# Altium project CNFET_PCB.PrjPcb (part 1 of 2)
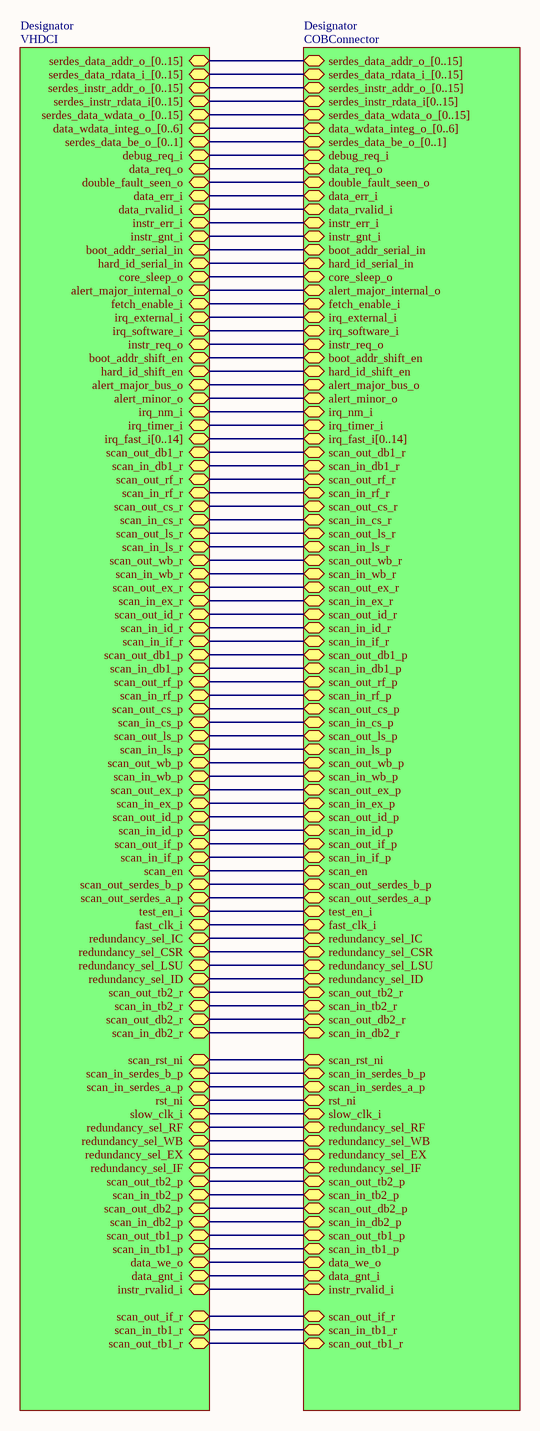
[diagram p0: Main.SchDoc]
3 sheets, 44 parts. Net scope: hierarchical (ports join the sheet entries above them; power ports are global).
Board file: CNFET.PcbDoc
Sheets:
  Main.SchDoc
    Designator = VHDCI.SchDoc
    Designator = COBConnector.SchDoc

## Sheet Main.SchDoc
size B portrait; SheetNumber: 1; SheetTotal: 3

### Sub-sheets
Designator = VHDCI: serdes_data_addr_o_[0..15] (bidir), serdes_data_rdata_i_[0..15] (bidir), serdes_instr_addr_o_[0..15] (bidir), serdes_instr_rdata_i[0..15] (bidir), serdes_data_wdata_o_[0..15] (bidir), data_wdata_integ_o_[0..6] (bidir), serdes_data_be_o_[0..1] (bidir), data_req_o (bidir), double_fault_seen_o (bidir), data_err_i (bidir), data_rvalid_i (bidir), instr_err_i (bidir), instr_gnt_i (bidir), boot_addr_serial_in (bidir), hard_id_serial_in (bidir), core_sleep_o (bidir), alert_major_internal_o (bidir), fetch_enable_i (bidir), irq_external_i (bidir), irq_software_i (bidir), instr_req_o (bidir), boot_addr_shift_en (bidir), hard_id_shift_en (bidir), alert_major_bus_o (bidir), alert_minor_o (bidir), irq_nm_i (bidir), irq_timer_i (bidir), irq_fast_i[0..14] (bidir), scan_out_db1_r (bidir), scan_in_db1_r (bidir), scan_out_rf_r (bidir), scan_in_rf_r (bidir), scan_out_cs_r (bidir), scan_in_cs_r (bidir), scan_out_ls_r (bidir), scan_in_ls_r (bidir), scan_out_wb_r (bidir), scan_in_wb_r (bidir), scan_out_ex_r (bidir), scan_in_ex_r (bidir), scan_out_id_r (bidir), scan_in_id_r (bidir), scan_out_if_r (bidir), scan_in_if_r (bidir), scan_out_db1_p (bidir), scan_in_db1_p (bidir), scan_out_rf_p (bidir), scan_in_rf_p (bidir), scan_out_cs_p (bidir), scan_in_cs_p (bidir), scan_out_ls_p (bidir), scan_in_ls_p (bidir), scan_out_wb_p (bidir), scan_in_wb_p (bidir), scan_out_ex_p (bidir), scan_in_ex_p (bidir), scan_out_id_p (bidir), scan_in_id_p (bidir), scan_out_if_p (bidir), scan_in_if_p (bidir), scan_en (bidir), scan_out_serdes_b_p (bidir), scan_out_serdes_a_p (bidir), test_en_i (bidir), fast_clk_i (bidir), redundancy_sel_IC (bidir), redundancy_sel_CSR (bidir), redundancy_sel_LSU (bidir), redundancy_sel_ID (bidir), scan_out_tb2_r (bidir), scan_in_tb2_r (bidir), scan_out_db2_r (bidir), scan_in_db2_r (bidir), scan_rst_ni (bidir), scan_in_serdes_b_p (bidir), scan_in_serdes_a_p (bidir), rst_ni (bidir), slow_clk_i (bidir), redundancy_sel_RF (bidir), redundancy_sel_WB (bidir), redundancy_sel_EX (bidir), redundancy_sel_IF (bidir), scan_out_tb2_p (bidir), scan_in_tb2_p (bidir), scan_out_db2_p (bidir), scan_in_db2_p (bidir), scan_out_tb1_p (bidir), scan_in_tb1_p (bidir), debug_req_i (bidir), data_we_o (bidir), data_gnt_i (bidir), instr_rvalid_i (bidir), scan_in_tb1_r (bidir), scan_out_tb1_r (bidir)
Designator = COBConnector: serdes_data_addr_o_[0..15] (bidir), serdes_data_rdata_i_[0..15] (bidir), serdes_instr_addr_o_[0..15] (bidir), serdes_data_wdata_o_[0..15] (bidir), data_wdata_integ_o_[0..6] (bidir), serdes_data_be_o_[0..1] (bidir), debug_req_i (bidir), data_req_o (bidir), double_fault_seen_o (bidir), data_err_i (bidir), data_rvalid_i (bidir), data_we_o (bidir), data_gnt_i (bidir), instr_err_i (bidir), instr_gnt_i (bidir), boot_addr_serial_in (bidir), hard_id_serial_in (bidir), core_sleep_o (bidir), alert_major_internal_o (bidir), fetch_enable_i (bidir), irq_external_i (bidir), irq_software_i (bidir), instr_req_o (bidir), boot_addr_shift_en (bidir), hard_id_shift_en (bidir), alert_major_bus_o (bidir), alert_minor_o (bidir), irq_nm_i (bidir), irq_timer_i (bidir), irq_fast_i[0..14] (bidir), scan_out_db1_r (bidir), scan_in_db1_r (bidir), scan_out_rf_r (bidir), scan_in_rf_r (bidir), scan_out_cs_r (bidir), scan_in_cs_r (bidir), scan_out_ls_r (bidir), scan_in_ls_r (bidir), scan_out_wb_r (bidir), scan_in_wb_r (bidir), scan_out_ex_r (bidir), scan_in_ex_r (bidir), scan_out_id_r (bidir), scan_out_if_r (bidir), scan_in_if_r (bidir), scan_out_db1_p (bidir), scan_in_db1_p (bidir), scan_out_rf_p (bidir), scan_in_rf_p (bidir), scan_out_cs_p (bidir), scan_in_cs_p (bidir), scan_out_ls_p (bidir), scan_in_ls_p (bidir), scan_out_wb_p (bidir), scan_in_wb_p (bidir), scan_out_ex_p (bidir), scan_in_ex_p (bidir), scan_out_id_p (bidir), scan_in_id_p (bidir), scan_out_if_p (bidir), scan_in_if_p (bidir), scan_en (bidir), scan_out_serdes_b_p (bidir), scan_out_serdes_a_p (bidir), test_en_i (bidir), fast_clk_i (bidir), redundancy_sel_IC (bidir), redundancy_sel_CSR (bidir), redundancy_sel_LSU (bidir), redundancy_sel_ID (bidir), scan_out_tb2_r (bidir), scan_in_tb2_r (bidir), scan_out_db2_r (bidir), scan_in_db2_r (bidir), scan_rst_ni (bidir), scan_in_serdes_b_p (bidir), scan_in_serdes_a_p (bidir), rst_ni (bidir), slow_clk_i (bidir), redundancy_sel_RF (bidir), redundancy_sel_WB (bidir), redundancy_sel_EX (bidir), redundancy_sel_IF (bidir), scan_out_tb2_p (bidir), scan_in_tb2_p (bidir), scan_out_db2_p (bidir), scan_in_db2_p (bidir), scan_out_tb1_p (bidir), scan_in_tb1_p (bidir), scan_in_id_r (bidir), serdes_instr_rdata_i[0..15] (bidir), instr_rvalid_i (bidir), scan_out_tb1_r (bidir), scan_in_tb1_r (bidir)

### Nets
alert_major_bus_o: sheet Designator/alert_major_bus_o, sheet Designator/alert_major_bus_o
alert_major_internal_o: sheet Designator/alert_major_internal_o, sheet Designator/alert_major_internal_o
alert_minor_o: sheet Designator/alert_minor_o, sheet Designator/alert_minor_o
boot_addr_serial_in: sheet Designator/boot_addr_serial_in, sheet Designator/boot_addr_serial_in
boot_addr_shift_en: sheet Designator/boot_addr_shift_en, sheet Designator/boot_addr_shift_en
core_sleep_o: sheet Designator/core_sleep_o, sheet Designator/core_sleep_o
data_err_i: sheet Designator/data_err_i, sheet Designator/data_err_i
data_gnt_i: sheet Designator/data_gnt_i, sheet Designator/data_gnt_i
data_req_o: sheet Designator/data_req_o, sheet Designator/data_req_o
data_rvalid_i: sheet Designator/data_rvalid_i, sheet Designator/data_rvalid_i
data_we_o: sheet Designator/data_we_o, sheet Designator/data_we_o
debug_req_i: sheet Designator/debug_req_i, sheet Designator/debug_req_i
double_fault_seen_o: sheet Designator/double_fault_seen_o, sheet Designator/double_fault_seen_o
fast_clk_i: sheet Designator/fast_clk_i, sheet Designator/fast_clk_i
fetch_enable_i: sheet Designator/fetch_enable_i, sheet Designator/fetch_enable_i
hard_id_serial_in: sheet Designator/hard_id_serial_in, sheet Designator/hard_id_serial_in
hard_id_shift_en: sheet Designator/hard_id_shift_en, sheet Designator/hard_id_shift_en
instr_err_i: sheet Designator/instr_err_i, sheet Designator/instr_err_i
instr_gnt_i: sheet Designator/instr_gnt_i, sheet Designator/instr_gnt_i
instr_req_o: sheet Designator/instr_req_o, sheet Designator/instr_req_o
instr_rvalid_i: sheet Designator/instr_rvalid_i, sheet Designator/instr_rvalid_i
irq_external_i: sheet Designator/irq_external_i, sheet Designator/irq_external_i
irq_nm_i: sheet Designator/irq_nm_i, sheet Designator/irq_nm_i
irq_software_i: sheet Designator/irq_software_i, sheet Designator/irq_software_i
irq_timer_i: sheet Designator/irq_timer_i, sheet Designator/irq_timer_i
redundancy_sel_CSR: sheet Designator/redundancy_sel_CSR, sheet Designator/redundancy_sel_CSR
redundancy_sel_EX: sheet Designator/redundancy_sel_EX, sheet Designator/redundancy_sel_EX
redundancy_sel_IC: sheet Designator/redundancy_sel_IC, sheet Designator/redundancy_sel_IC
redundancy_sel_ID: sheet Designator/redundancy_sel_ID, sheet Designator/redundancy_sel_ID
redundancy_sel_IF: sheet Designator/redundancy_sel_IF, sheet Designator/redundancy_sel_IF
redundancy_sel_LSU: sheet Designator/redundancy_sel_LSU, sheet Designator/redundancy_sel_LSU
redundancy_sel_RF: sheet Designator/redundancy_sel_RF, sheet Designator/redundancy_sel_RF
redundancy_sel_WB: sheet Designator/redundancy_sel_WB, sheet Designator/redundancy_sel_WB
rst_ni: sheet Designator/rst_ni, sheet Designator/rst_ni
scan_en: sheet Designator/scan_en, sheet Designator/scan_en
scan_in_cs_p: sheet Designator/scan_in_cs_p, sheet Designator/scan_in_cs_p
scan_in_cs_r: sheet Designator/scan_in_cs_r, sheet Designator/scan_in_cs_r
scan_in_db1_p: sheet Designator/scan_in_db1_p, sheet Designator/scan_in_db1_p
scan_in_db1_r: sheet Designator/scan_in_db1_r, sheet Designator/scan_in_db1_r
scan_in_db2_p: sheet Designator/scan_in_db2_p, sheet Designator/scan_in_db2_p
scan_in_db2_r: sheet Designator/scan_in_db2_r, sheet Designator/scan_in_db2_r
scan_in_ex_p: sheet Designator/scan_in_ex_p, sheet Designator/scan_in_ex_p
scan_in_ex_r: sheet Designator/scan_in_ex_r, sheet Designator/scan_in_ex_r
scan_in_id_p: sheet Designator/scan_in_id_p, sheet Designator/scan_in_id_p
scan_in_id_r: sheet Designator/scan_in_id_r, sheet Designator/scan_in_id_r
scan_in_if_p: sheet Designator/scan_in_if_p, sheet Designator/scan_in_if_p
scan_in_if_r: sheet Designator/scan_in_if_r, sheet Designator/scan_in_if_r
scan_in_ls_p: sheet Designator/scan_in_ls_p, sheet Designator/scan_in_ls_p
scan_in_ls_r: sheet Designator/scan_in_ls_r, sheet Designator/scan_in_ls_r
scan_in_rf_p: sheet Designator/scan_in_rf_p, sheet Designator/scan_in_rf_p
scan_in_rf_r: sheet Designator/scan_in_rf_r, sheet Designator/scan_in_rf_r
scan_in_serdes_a_p: sheet Designator/scan_in_serdes_a_p, sheet Designator/scan_in_serdes_a_p
scan_in_serdes_b_p: sheet Designator/scan_in_serdes_b_p, sheet Designator/scan_in_serdes_b_p
scan_in_tb1_p: sheet Designator/scan_in_tb1_p, sheet Designator/scan_in_tb1_p
scan_in_tb1_r: sheet Designator/scan_in_tb1_r, sheet Designator/scan_in_tb1_r
scan_in_tb2_p: sheet Designator/scan_in_tb2_p, sheet Designator/scan_in_tb2_p
scan_in_tb2_r: sheet Designator/scan_in_tb2_r, sheet Designator/scan_in_tb2_r
scan_in_wb_p: sheet Designator/scan_in_wb_p, sheet Designator/scan_in_wb_p
scan_in_wb_r: sheet Designator/scan_in_wb_r, sheet Designator/scan_in_wb_r
scan_out_cs_p: sheet Designator/scan_out_cs_p, sheet Designator/scan_out_cs_p
scan_out_cs_r: sheet Designator/scan_out_cs_r, sheet Designator/scan_out_cs_r
scan_out_db1_p: sheet Designator/scan_out_db1_p, sheet Designator/scan_out_db1_p
scan_out_db1_r: sheet Designator/scan_out_db1_r, sheet Designator/scan_out_db1_r
scan_out_db2_p: sheet Designator/scan_out_db2_p, sheet Designator/scan_out_db2_p
scan_out_db2_r: sheet Designator/scan_out_db2_r, sheet Designator/scan_out_db2_r
scan_out_ex_p: sheet Designator/scan_out_ex_p, sheet Designator/scan_out_ex_p
scan_out_ex_r: sheet Designator/scan_out_ex_r, sheet Designator/scan_out_ex_r
scan_out_id_p: sheet Designator/scan_out_id_p, sheet Designator/scan_out_id_p
scan_out_id_r: sheet Designator/scan_out_id_r, sheet Designator/scan_out_id_r
scan_out_if_p: sheet Designator/scan_out_if_p, sheet Designator/scan_out_if_p
scan_out_if_r: sheet Designator/scan_out_if_r, sheet Designator/scan_out_if_r
scan_out_ls_p: sheet Designator/scan_out_ls_p, sheet Designator/scan_out_ls_p
scan_out_ls_r: sheet Designator/scan_out_ls_r, sheet Designator/scan_out_ls_r
scan_out_rf_p: sheet Designator/scan_out_rf_p, sheet Designator/scan_out_rf_p
scan_out_rf_r: sheet Designator/scan_out_rf_r, sheet Designator/scan_out_rf_r
scan_out_serdes_a_p: sheet Designator/scan_out_serdes_a_p, sheet Designator/scan_out_serdes_a_p
scan_out_serdes_b_p: sheet Designator/scan_out_serdes_b_p, sheet Designator/scan_out_serdes_b_p
scan_out_tb1_p: sheet Designator/scan_out_tb1_p, sheet Designator/scan_out_tb1_p
scan_out_tb1_r: sheet Designator/scan_out_tb1_r, sheet Designator/scan_out_tb1_r
scan_out_tb2_p: sheet Designator/scan_out_tb2_p, sheet Designator/scan_out_tb2_p
scan_out_tb2_r: sheet Designator/scan_out_tb2_r, sheet Designator/scan_out_tb2_r
scan_out_wb_p: sheet Designator/scan_out_wb_p, sheet Designator/scan_out_wb_p
scan_out_wb_r: sheet Designator/scan_out_wb_r, sheet Designator/scan_out_wb_r
scan_rst_ni: sheet Designator/scan_rst_ni, sheet Designator/scan_rst_ni
slow_clk_i: sheet Designator/slow_clk_i, sheet Designator/slow_clk_i
test_en_i: sheet Designator/test_en_i, sheet Designator/test_en_i

## Sheet VHDCI.SchDoc
size C; SheetNumber: 3; SheetTotal: 3
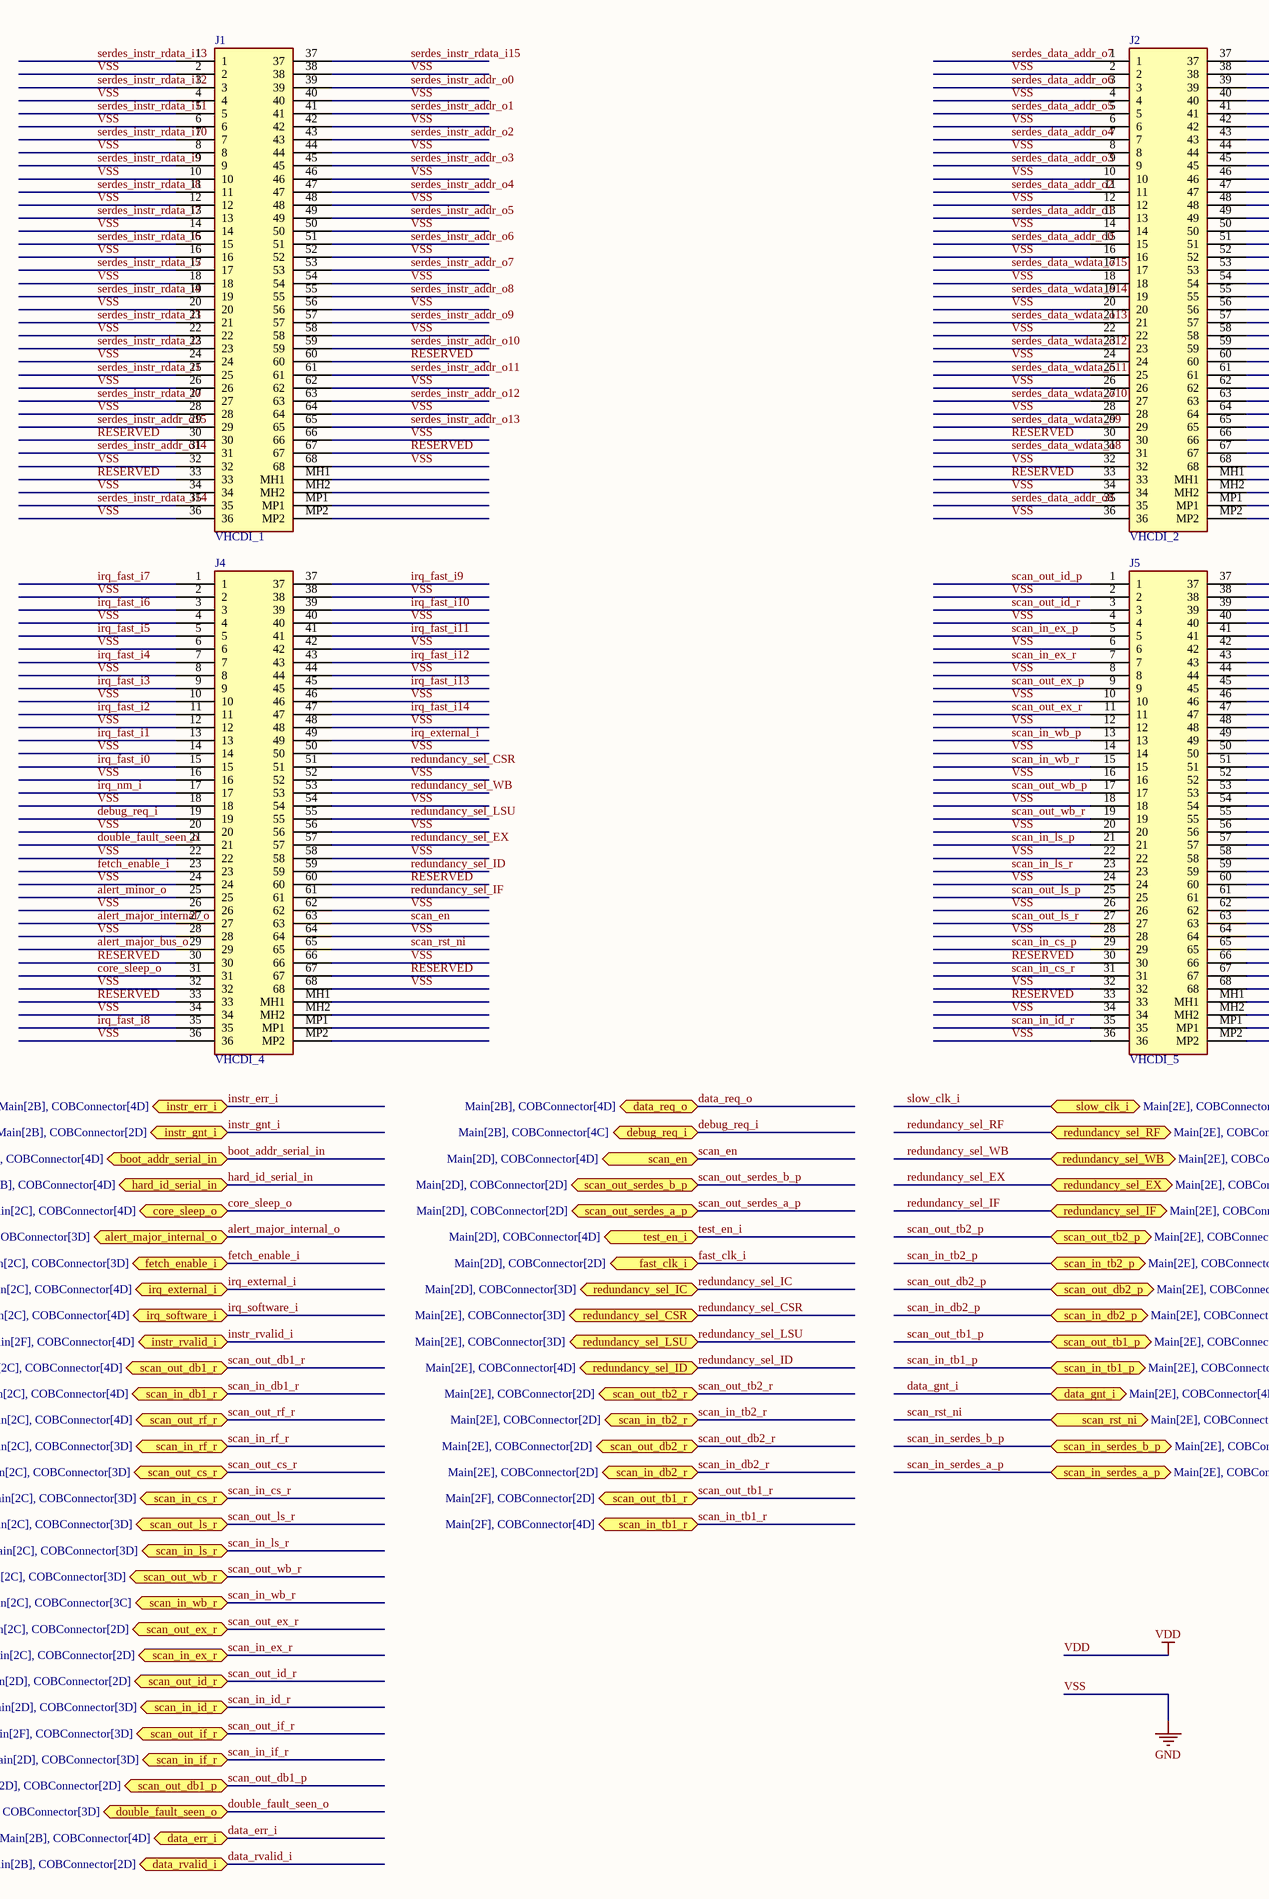
[diagram p1: VHDCI.SchDoc, left]
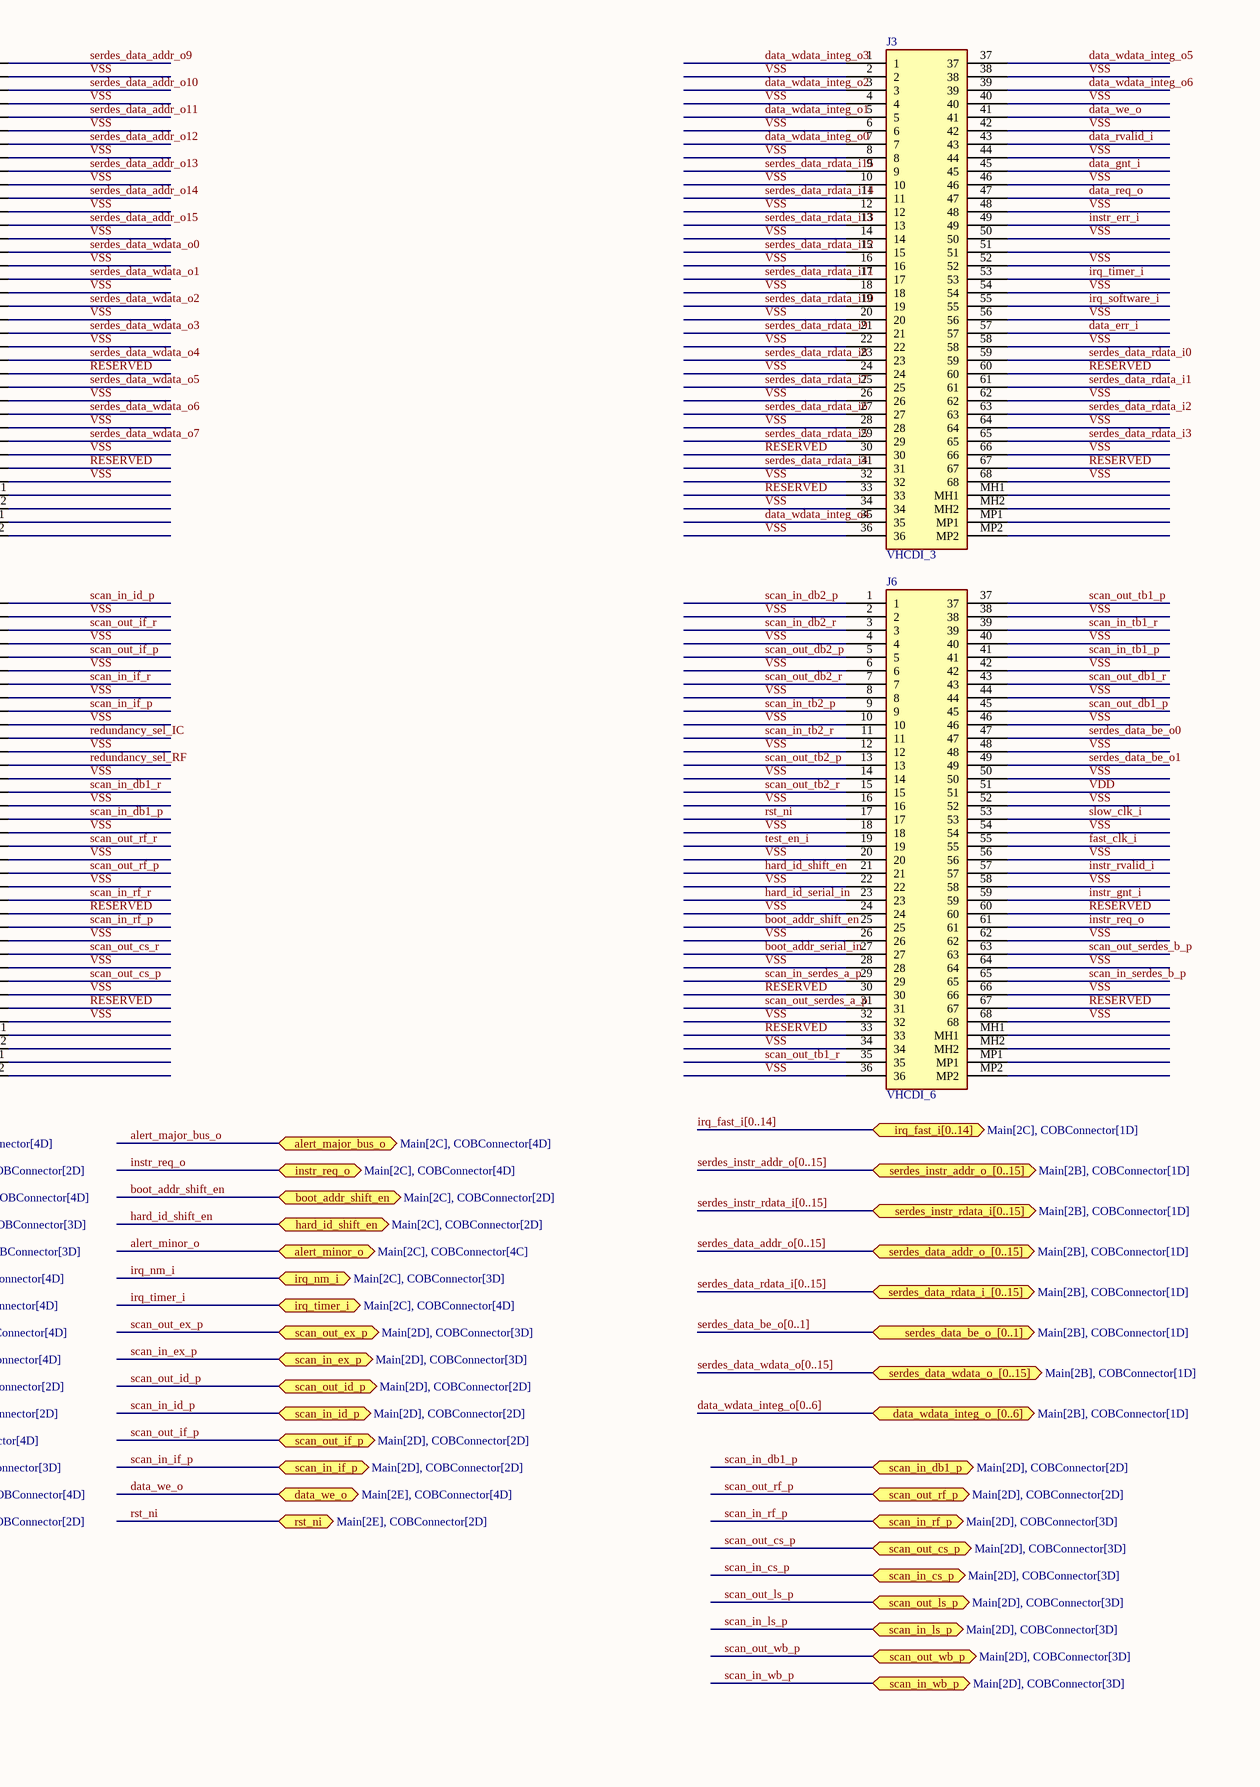
[diagram p2: VHDCI.SchDoc, right]

### Parts
J1  VHCDI_1  [CONN68_HDRA-EC_HON]
J2  VHCDI_2  [CONN68_HDRA-EC_HON]
J3  VHCDI_3  [CONN68_HDRA-EC_HON]
J4  VHCDI_4  [CONN68_HDRA-EC_HON]
J5  VHCDI_5  [CONN68_HDRA-EC_HON]
J6  VHCDI_6  [CONN68_HDRA-EC_HON]

### Ports
alert_major_bus_o (bidir, see Main[2C], COBConnector[4D]), alert_major_internal_o (bidir, see Main[2C], COBConnector[3D]), alert_minor_o (bidir, see Main[2C], COBConnector[4C]), boot_addr_serial_in (bidir, see Main[2B], COBConnector[4D]), boot_addr_shift_en (bidir, see Main[2C], COBConnector[2D]), core_sleep_o (bidir, see Main[2C], COBConnector[4D]), data_err_i (bidir, see Main[2B], COBConnector[4D]), data_gnt_i (bidir, see Main[2E], COBConnector[4D]), data_req_o (bidir, see Main[2B], COBConnector[4D]), data_rvalid_i (bidir, see Main[2B], COBConnector[2D]), data_wdata_integ_o_[0..6] (bidir, see Main[2B], COBConnector[1D]), data_we_o (bidir, see Main[2E], COBConnector[4D]), debug_req_i (bidir, see Main[2B], COBConnector[4C]), double_fault_seen_o (bidir, see Main[2B], COBConnector[3D]), fast_clk_i (bidir, see Main[2D], COBConnector[2D]), fetch_enable_i (bidir, see Main[2C], COBConnector[3D]), hard_id_serial_in (bidir, see Main[2B], COBConnector[4D]), hard_id_shift_en (bidir, see Main[2C], COBConnector[2D]), instr_err_i (bidir, see Main[2B], COBConnector[4D]), instr_gnt_i (bidir, see Main[2B], COBConnector[2D]), instr_req_o (bidir, see Main[2C], COBConnector[4D]), instr_rvalid_i (bidir, see Main[2F], COBConnector[4D]), irq_external_i (bidir, see Main[2C], COBConnector[4D]), irq_fast_i[0..14] (bidir, see Main[2C], COBConnector[1D]), irq_nm_i (bidir, see Main[2C], COBConnector[3D]), irq_software_i (bidir, see Main[2C], COBConnector[4D]), irq_timer_i (bidir, see Main[2C], COBConnector[4D]), redundancy_sel_CSR (bidir, see Main[2E], COBConnector[3D]), redundancy_sel_EX (bidir, see Main[2E], COBConnector[3D]), redundancy_sel_IC (bidir, see Main[2D], COBConnector[3D]), redundancy_sel_ID (bidir, see Main[2E], COBConnector[4D]), redundancy_sel_IF (bidir, see Main[2E], COBConnector[3D]), redundancy_sel_LSU (bidir, see Main[2E], COBConnector[3D]), redundancy_sel_RF (bidir, see Main[2E], COBConnector[2D]), redundancy_sel_WB (bidir, see Main[2E], COBConnector[4D]), rst_ni (bidir, see Main[2E], COBConnector[2D]), scan_en (bidir, see Main[2D], COBConnector[4D]), scan_in_cs_p (bidir, see Main[2D], COBConnector[3D]), scan_in_cs_r (bidir, see Main[2C], COBConnector[3D]), scan_in_db1_p (bidir, see Main[2D], COBConnector[2D]), scan_in_db1_r (bidir, see Main[2C], COBConnector[4D]), scan_in_db2_p (bidir, see Main[2E], COBConnector[4D]), scan_in_db2_r (bidir, see Main[2E], COBConnector[2D]), scan_in_ex_p (bidir, see Main[2D], COBConnector[3D]), scan_in_ex_r (bidir, see Main[2C], COBConnector[2D]), scan_in_id_p (bidir, see Main[2D], COBConnector[2D]), scan_in_id_r (bidir, see Main[2D], COBConnector[3D]), scan_in_if_p (bidir, see Main[2D], COBConnector[2D]), scan_in_if_r (bidir, see Main[2D], COBConnector[3D]), scan_in_ls_p (bidir, see Main[2D], COBConnector[3D]), scan_in_ls_r (bidir, see Main[2C], COBConnector[3D]), scan_in_rf_p (bidir, see Main[2D], COBConnector[3D]), scan_in_rf_r (bidir, see Main[2C], COBConnector[3D]), scan_in_serdes_a_p (bidir, see Main[2E], COBConnector[2D]), scan_in_serdes_b_p (bidir, see Main[2E], COBConnector[4D]), scan_in_tb1_p (bidir, see Main[2E], COBConnector[2D]), scan_in_tb1_r (bidir, see Main[2F], COBConnector[4D]), scan_in_tb2_p (bidir, see Main[2E], COBConnector[4D]), scan_in_tb2_r (bidir, see Main[2E], COBConnector[2D]), scan_in_wb_p (bidir, see Main[2D], COBConnector[3D]), scan_in_wb_r (bidir, see Main[2C], COBConnector[3C]), scan_out_cs_p (bidir, see Main[2D], COBConnector[3D]), scan_out_cs_r (bidir, see Main[2C], COBConnector[3D]), scan_out_db1_p (bidir, see Main[2D], COBConnector[2D]), scan_out_db1_r (bidir, see Main[2C], COBConnector[4D]), scan_out_db2_p (bidir, see Main[2E], COBConnector[4D]), scan_out_db2_r (bidir, see Main[2E], COBConnector[2D]), scan_out_ex_p (bidir, see Main[2D], COBConnector[3D]), scan_out_ex_r (bidir, see Main[2C], COBConnector[2D]), scan_out_id_p (bidir, see Main[2D], COBConnector[2D]), scan_out_id_r (bidir, see Main[2D], COBConnector[2D]), scan_out_if_p (bidir, see Main[2D], COBConnector[2D]), scan_out_if_r (bidir, see Main[2F], COBConnector[3D]), scan_out_ls_p (bidir, see Main[2D], COBConnector[3D]), scan_out_ls_r (bidir, see Main[2C], COBConnector[3D]), scan_out_rf_p (bidir, see Main[2D], COBConnector[2D]), scan_out_rf_r (bidir, see Main[2C], COBConnector[4D]), scan_out_serdes_a_p (bidir, see Main[2D], COBConnector[2D]), scan_out_serdes_b_p (bidir, see Main[2D], COBConnector[2D]), scan_out_tb1_p (bidir, see Main[2E], COBConnector[2D]), scan_out_tb1_r (bidir, see Main[2F], COBConnector[2D]), scan_out_tb2_p (bidir, see Main[2E], COBConnector[4D]), scan_out_tb2_r (bidir, see Main[2E], COBConnector[2D]), scan_out_wb_p (bidir, see Main[2D], COBConnector[3D]), scan_out_wb_r (bidir, see Main[2C], COBConnector[3D]), scan_rst_ni (bidir, see Main[2E], COBConnector[3D]), serdes_data_addr_o_[0..15] (bidir, see Main[2B], COBConnector[1D]), serdes_data_be_o_[0..1] (bidir, see Main[2B], COBConnector[1D]), serdes_data_rdata_i_[0..15] (bidir, see Main[2B], COBConnector[1D]), serdes_data_wdata_o_[0..15] (bidir, see Main[2B], COBConnector[1D]), serdes_instr_addr_o_[0..15] (bidir, see Main[2B], COBConnector[1D]), serdes_instr_rdata_i[0..15] (bidir, see Main[2B], COBConnector[1D]), slow_clk_i (bidir, see Main[2E], COBConnector[4D]), test_en_i (bidir, see Main[2D], COBConnector[4D])

### Nets
VDD: J6.51
VSS: J1.2 J1.4 J1.6 J1.8 J1.10 J1.12 J1.14 J1.16 J1.18 J1.20 J1.22 J1.24 J1.26 J1.28 J1.32 J1.34 J1.36 J1.38 J1.40 J1.42 J1.44 J1.46 J1.48 J1.50 J1.52 J1.54 J1.56 J1.58 J1.62 J1.64 J1.66 J1.68 J2.2 J2.4 J2.6 J2.8 J2.10 J2.12 J2.14 J2.16 J2.18 J2.20 J2.22 J2.24 J2.26 J2.28 J2.32 J2.34 J2.36 J2.38 J2.40 J2.42 J2.44 J2.46 J2.48 J2.50 J2.52 J2.54 J2.56 J2.58 J2.62 J2.64 J2.66 J2.68 J3.2 J3.4 J3.6 J3.8 J3.10 J3.12 J3.14 J3.16 J3.18 J3.20 J3.22 J3.24 J3.26 J3.28 J3.32 J3.34 J3.36 J3.38 J3.40 J3.42 J3.44 J3.46 J3.48 J3.50 J3.52 J3.54 J3.56 J3.58 J3.62 J3.64 J3.66 J3.68 J4.2 J4.4 J4.6 J4.8 J4.10 J4.12 J4.14 J4.16 J4.18 J4.20 J4.22 J4.24 J4.26 J4.28 J4.32 J4.34 J4.36 J4.38 J4.40 J4.42 J4.44 J4.46 J4.48 J4.50 J4.52 J4.54 J4.56 J4.58 J4.62 J4.64 J4.66 J4.68 J5.2 J5.4 J5.6 J5.8 J5.10 J5.12 J5.14 J5.16 J5.18 J5.20 J5.22 J5.24 J5.26 J5.28 J5.32 J5.34 J5.36 J5.38 J5.40 J5.42 J5.44 J5.46 J5.48 J5.50 J5.52 J5.54 J5.56 J5.58 J5.62 J5.64 J5.66 J5.68 J6.2 J6.4 J6.6 J6.8 J6.10 J6.12 J6.14 J6.16 J6.18 J6.20 J6.22 J6.24 J6.26 J6.28 J6.32 J6.34 J6.36 J6.38 J6.40 J6.42 J6.44 J6.46 J6.48 J6.50 J6.52 J6.54 J6.56 J6.58 J6.62 J6.64 J6.66 J6.68  [also labelled GND]
alert_major_bus_o: J4.29 ; port alert_major_bus_o
alert_major_internal_o: J4.27 ; port alert_major_internal_o
alert_minor_o: J4.25 ; port alert_minor_o
boot_addr_serial_in: J6.27 ; port boot_addr_serial_in
boot_addr_shift_en: J6.25 ; port boot_addr_shift_en
core_sleep_o: J4.31 ; port core_sleep_o
data_err_i: J3.57 ; port data_err_i
data_gnt_i: J3.45 ; port data_gnt_i
data_req_o: J3.47 ; port data_req_o
data_rvalid_i: J3.43 ; port data_rvalid_i
data_wdata_integ_o0: J3.7
data_wdata_integ_o1: J3.5
data_wdata_integ_o2: J3.3
data_wdata_integ_o3: J3.1
data_wdata_integ_o4: J3.35
data_wdata_integ_o5: J3.37
data_wdata_integ_o6: J3.39
data_we_o: J3.41 ; port data_we_o
debug_req_i: J4.19 ; port debug_req_i
double_fault_seen_o: J4.21 ; port double_fault_seen_o
fast_clk_i: J6.55 ; port fast_clk_i
fetch_enable_i: J4.23 ; port fetch_enable_i
hard_id_serial_in: J6.23 ; port hard_id_serial_in
hard_id_shift_en: J6.21 ; port hard_id_shift_en
instr_err_i: J3.49 ; port instr_err_i
instr_gnt_i: J6.59 ; port instr_gnt_i
instr_req_o: J6.61 ; port instr_req_o
instr_rvalid_i: J6.57 ; port instr_rvalid_i
irq_external_i: J4.49 ; port irq_external_i
irq_fast_i0: J4.15
irq_fast_i1: J4.13
irq_fast_i2: J4.11
irq_fast_i3: J4.9
irq_fast_i4: J4.7
irq_fast_i5: J4.5
irq_fast_i6: J4.3
irq_fast_i7: J4.1
irq_fast_i8: J4.35
irq_fast_i9: J4.37
irq_fast_i10: J4.39
irq_fast_i11: J4.41
irq_fast_i12: J4.43
irq_fast_i13: J4.45
irq_fast_i14: J4.47
irq_nm_i: J4.17 ; port irq_nm_i
irq_software_i: J3.55 ; port irq_software_i
irq_timer_i: J3.53 ; port irq_timer_i
redundancy_sel_CSR: J4.51 ; port redundancy_sel_CSR
redundancy_sel_EX: J4.57 ; port redundancy_sel_EX
redundancy_sel_IC: J5.47 ; port redundancy_sel_IC
redundancy_sel_ID: J4.59 ; port redundancy_sel_ID
redundancy_sel_IF: J4.61 ; port redundancy_sel_IF
redundancy_sel_LSU: J4.55 ; port redundancy_sel_LSU
redundancy_sel_RF: J5.49 ; port redundancy_sel_RF
redundancy_sel_WB: J4.53 ; port redundancy_sel_WB
RESERVED: J1.30 J1.33 J1.60 J1.67 J2.30 J2.33 J2.60 J2.67 J3.30 J3.33 J3.60 J3.67 J4.30 J4.33 J4.60 J4.67 J5.30 J5.33 J5.60 J5.67 J6.30 J6.33 J6.60 J6.67
rst_ni: J6.17 ; port rst_ni
scan_en: J4.63 ; port scan_en
scan_in_cs_p: J5.29 ; port scan_in_cs_p
scan_in_cs_r: J5.31 ; port scan_in_cs_r
scan_in_db1_p: J5.53 ; port scan_in_db1_p
scan_in_db1_r: J5.51 ; port scan_in_db1_r
scan_in_db2_p: J6.1 ; port scan_in_db2_p
scan_in_db2_r: J6.3 ; port scan_in_db2_r
scan_in_ex_p: J5.5 ; port scan_in_ex_p
scan_in_ex_r: J5.7 ; port scan_in_ex_r
scan_in_id_p: J5.37 ; port scan_in_id_p
scan_in_id_r: J5.35 ; port scan_in_id_r
scan_in_if_p: J5.45 ; port scan_in_if_p
scan_in_if_r: J5.43 ; port scan_in_if_r
scan_in_ls_p: J5.21 ; port scan_in_ls_p
scan_in_ls_r: J5.23 ; port scan_in_ls_r
scan_in_rf_p: J5.61 ; port scan_in_rf_p
scan_in_rf_r: J5.59 ; port scan_in_rf_r
scan_in_serdes_a_p: J6.29 ; port scan_in_serdes_a_p
scan_in_serdes_b_p: J6.65 ; port scan_in_serdes_b_p
scan_in_tb1_p: J6.41 ; port scan_in_tb1_p
scan_in_tb1_r: J6.39 ; port scan_in_tb1_r
scan_in_tb2_p: J6.9 ; port scan_in_tb2_p
scan_in_tb2_r: J6.11 ; port scan_in_tb2_r
scan_in_wb_p: J5.13 ; port scan_in_wb_p
scan_in_wb_r: J5.15 ; port scan_in_wb_r
scan_out_cs_p: J5.65 ; port scan_out_cs_p
scan_out_cs_r: J5.63 ; port scan_out_cs_r
scan_out_db1_p: J6.45 ; port scan_out_db1_p
scan_out_db1_r: J6.43 ; port scan_out_db1_r
scan_out_db2_p: J6.5 ; port scan_out_db2_p
scan_out_db2_r: J6.7 ; port scan_out_db2_r
scan_out_ex_p: J5.9 ; port scan_out_ex_p
scan_out_ex_r: J5.11 ; port scan_out_ex_r
scan_out_id_p: J5.1 ; port scan_out_id_p
scan_out_id_r: J5.3 ; port scan_out_id_r
scan_out_if_p: J5.41 ; port scan_out_if_p
scan_out_if_r: J5.39 ; port scan_out_if_r
scan_out_ls_p: J5.25 ; port scan_out_ls_p
scan_out_ls_r: J5.27 ; port scan_out_ls_r
scan_out_rf_p: J5.57 ; port scan_out_rf_p
scan_out_rf_r: J5.55 ; port scan_out_rf_r
scan_out_serdes_a_p: J6.31 ; port scan_out_serdes_a_p
scan_out_serdes_b_p: J6.63 ; port scan_out_serdes_b_p
scan_out_tb1_p: J6.37 ; port scan_out_tb1_p
scan_out_tb1_r: J6.35 ; port scan_out_tb1_r
scan_out_tb2_p: J6.13 ; port scan_out_tb2_p
scan_out_tb2_r: J6.15 ; port scan_out_tb2_r
scan_out_wb_p: J5.17 ; port scan_out_wb_p
scan_out_wb_r: J5.19 ; port scan_out_wb_r
scan_rst_ni: J4.65 ; port scan_rst_ni
serdes_data_addr_o0: J2.15
serdes_data_addr_o1: J2.13
serdes_data_addr_o2: J2.11
serdes_data_addr_o3: J2.9
serdes_data_addr_o4: J2.7
serdes_data_addr_o5: J2.5
serdes_data_addr_o6: J2.3
serdes_data_addr_o7: J2.1
serdes_data_addr_o8: J2.35
serdes_data_addr_o9: J2.37
serdes_data_addr_o10: J2.39
serdes_data_addr_o11: J2.41
serdes_data_addr_o12: J2.43
serdes_data_addr_o13: J2.45
serdes_data_addr_o14: J2.47
serdes_data_addr_o15: J2.49
serdes_data_be_o0: J6.47
serdes_data_be_o1: J6.49
serdes_data_rdata_i0: J3.59
serdes_data_rdata_i1: J3.61
serdes_data_rdata_i2: J3.63
serdes_data_rdata_i3: J3.65
serdes_data_rdata_i4: J3.31
serdes_data_rdata_i5: J3.29
serdes_data_rdata_i6: J3.27
serdes_data_rdata_i7: J3.25
serdes_data_rdata_i8: J3.23
serdes_data_rdata_i9: J3.21
serdes_data_rdata_i10: J3.19
serdes_data_rdata_i11: J3.17
serdes_data_rdata_i12: J3.15
serdes_data_rdata_i13: J3.13
serdes_data_rdata_i14: J3.11
serdes_data_rdata_i15: J3.9
serdes_data_wdata_o0: J2.51
serdes_data_wdata_o1: J2.53
serdes_data_wdata_o2: J2.55
serdes_data_wdata_o3: J2.57
serdes_data_wdata_o4: J2.59
serdes_data_wdata_o5: J2.61
serdes_data_wdata_o6: J2.63
serdes_data_wdata_o7: J2.65
serdes_data_wdata_o8: J2.31
serdes_data_wdata_o9: J2.29
serdes_data_wdata_o10: J2.27
serdes_data_wdata_o11: J2.25
serdes_data_wdata_o12: J2.23
serdes_data_wdata_o13: J2.21
serdes_data_wdata_o14: J2.19
serdes_data_wdata_o15: J2.17
serdes_instr_addr_o0: J1.39
serdes_instr_addr_o1: J1.41
serdes_instr_addr_o2: J1.43
serdes_instr_addr_o3: J1.45
serdes_instr_addr_o4: J1.47
serdes_instr_addr_o5: J1.49
serdes_instr_addr_o6: J1.51
serdes_instr_addr_o7: J1.53
serdes_instr_addr_o8: J1.55
serdes_instr_addr_o9: J1.57
serdes_instr_addr_o10: J1.59
serdes_instr_addr_o11: J1.61
serdes_instr_addr_o12: J1.63
serdes_instr_addr_o13: J1.65
serdes_instr_addr_o14: J1.31
serdes_instr_addr_o15: J1.29
serdes_instr_rdata_i0: J1.27
serdes_instr_rdata_i1: J1.25
serdes_instr_rdata_i2: J1.23
serdes_instr_rdata_i3: J1.21
serdes_instr_rdata_i4: J1.19
serdes_instr_rdata_i5: J1.17
serdes_instr_rdata_i6: J1.15
serdes_instr_rdata_i7: J1.13
serdes_instr_rdata_i8: J1.11
serdes_instr_rdata_i9: J1.9
serdes_instr_rdata_i10: J1.7
serdes_instr_rdata_i11: J1.5
serdes_instr_rdata_i12: J1.3
serdes_instr_rdata_i13: J1.1
serdes_instr_rdata_i14: J1.35
serdes_instr_rdata_i15: J1.37
slow_clk_i: J6.53 ; port slow_clk_i
test_en_i: J6.19 ; port test_en_i

Not connected (* = marked no-connect by the designer): J1 MH1 MH2 MP1 MP2; J2 MH1 MH2 MP1 MP2; J3 51 MH1 MH2 MP1 MP2; J4 MH1 MH2 MP1 MP2; J5 MH1 MH2 MP1 MP2; J6 MH1 MH2 MP1 MP2

### Buses and harness runs
bus data_wdata_integ_o[0..6] = port data_wdata_integ_o_[0..6]
bus irq_fast_i[0..14] = port irq_fast_i[0..14]
bus serdes_data_addr_o[0..15] = port serdes_data_addr_o_[0..15]
bus serdes_data_be_o[0..1] = port serdes_data_be_o_[0..1]
bus serdes_data_rdata_i[0..15] = port serdes_data_rdata_i_[0..15]
bus serdes_data_wdata_o[0..15] = port serdes_data_wdata_o_[0..15]
bus serdes_instr_addr_o[0..15] = port serdes_instr_addr_o_[0..15]
bus serdes_instr_rdata_i[0..15] = port serdes_instr_rdata_i[0..15]

### Library data of the parts
J1-J6 = 785633-01: Connector; Manufacturer_Name: NI; Datasheet Link: https://www.digikey.com/en/products/detail/ni/785633-01/16637125?s=N4IgTCBcDaIOwA4CsA2AzGkBdAvkA; Height: 10.8mm; Manufacturer_Part_Number: 785633-01

## Sheet COBConnector.SchDoc
size C; SheetNumber: 2; SheetTotal: 3
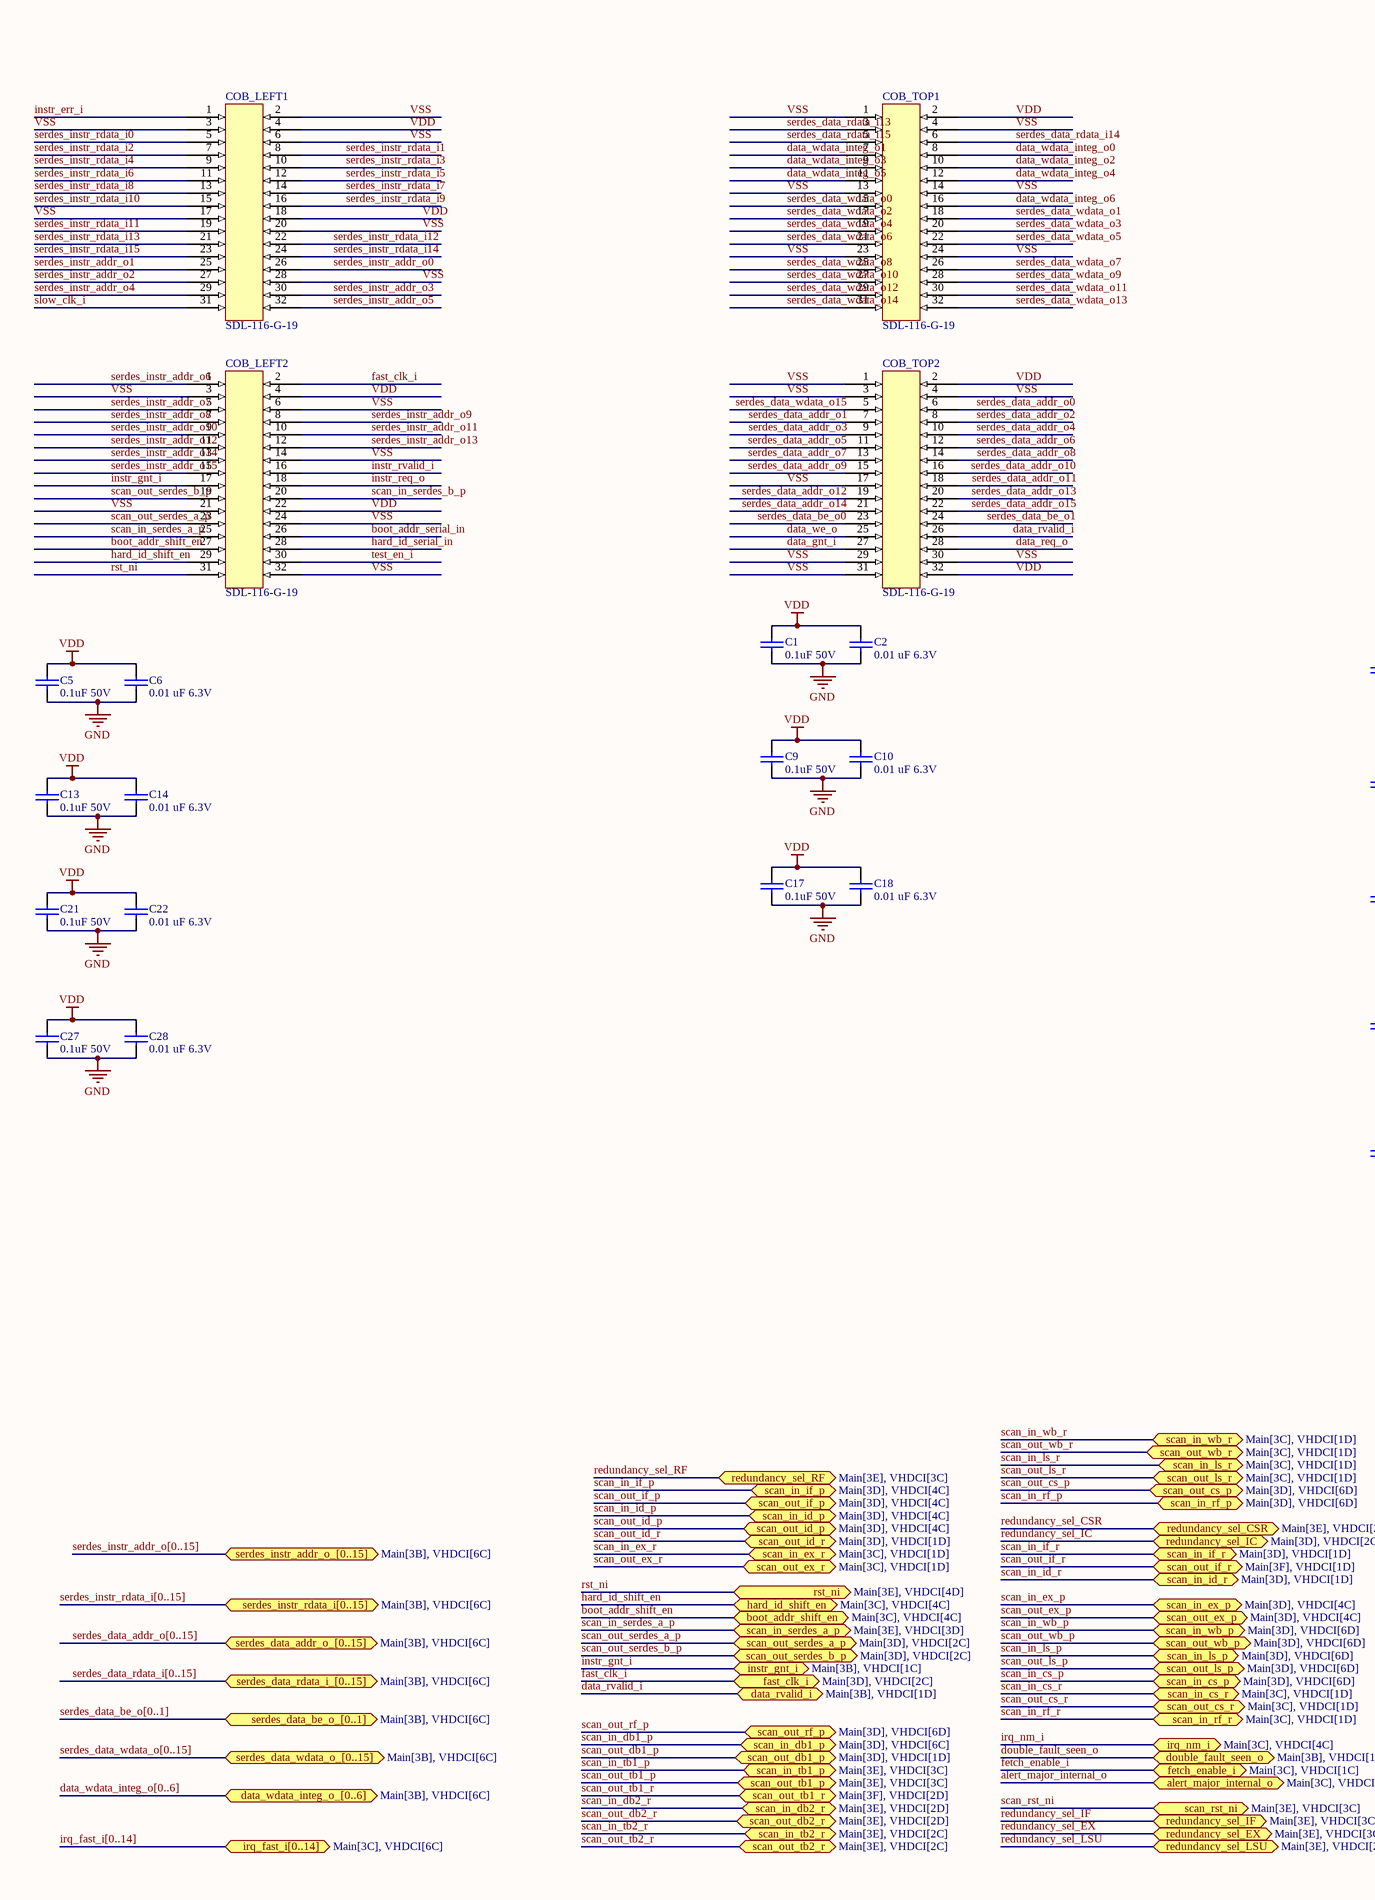
[diagram p3: COBConnector.SchDoc, left]
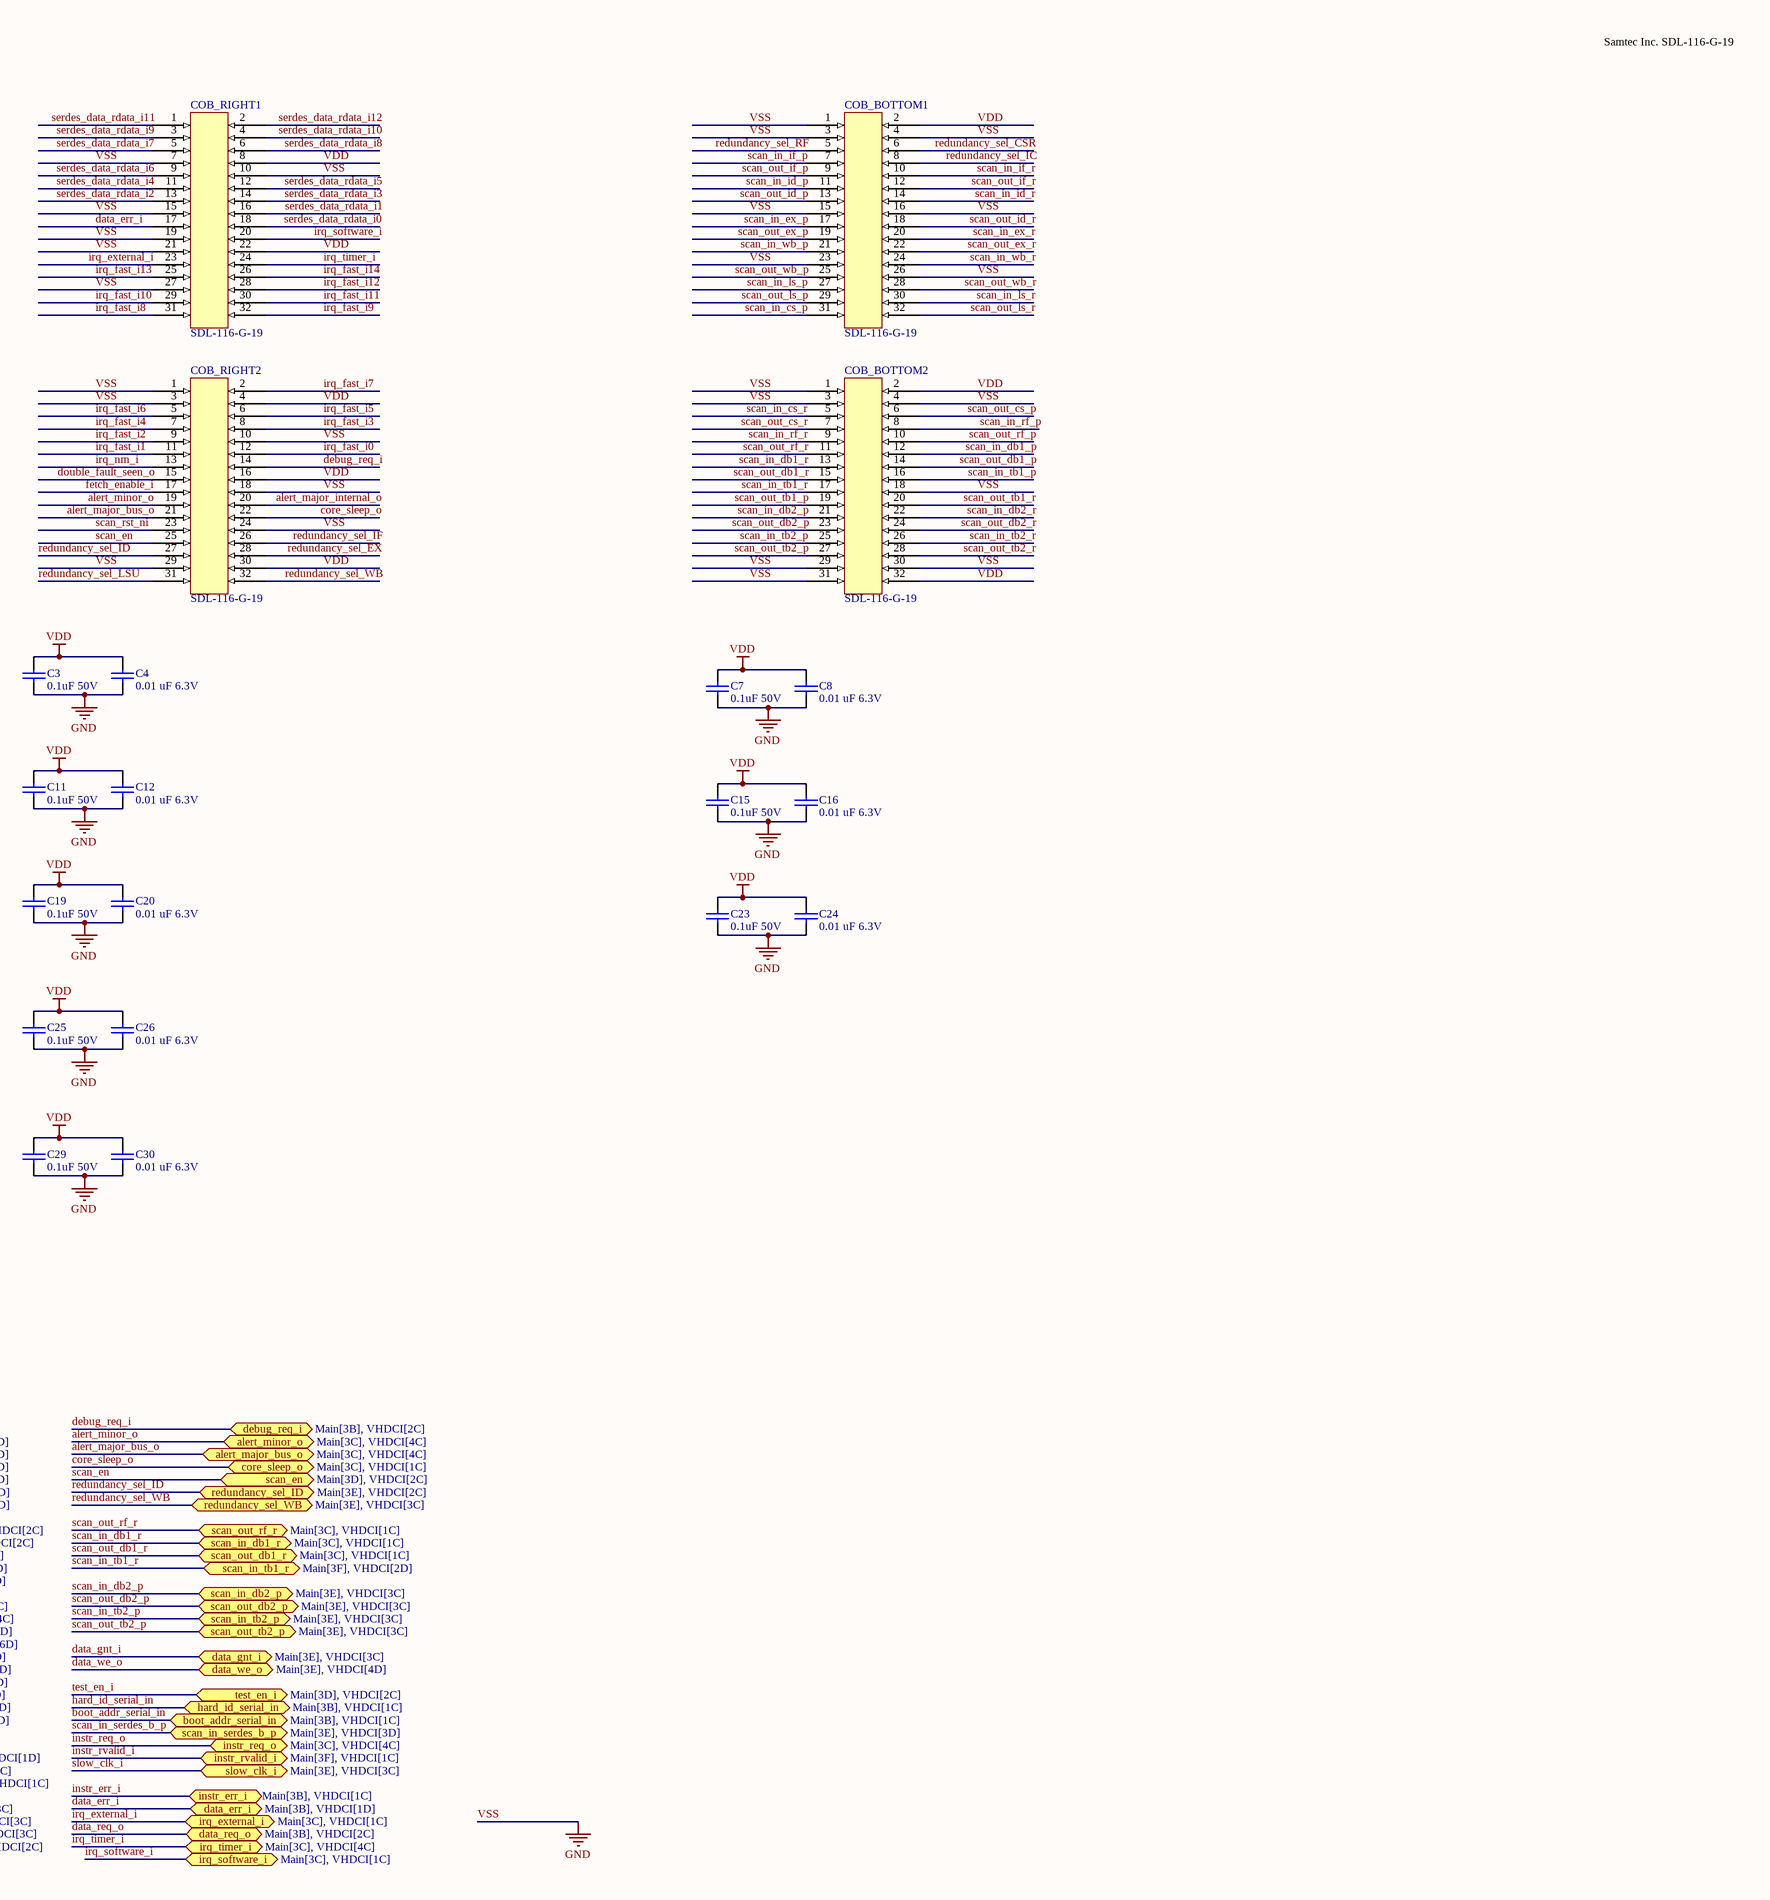
[diagram p4: COBConnector.SchDoc, right]

### Parts
C1  0.1uF 50V  [C0603-XXXXXX-XXX]
C2  0.01 uF 6.3V  [C0603-XXXXXX-XXX]
C3  0.1uF 50V  [C0603-XXXXXX-XXX]
C4  0.01 uF 6.3V  [C0603-XXXXXX-XXX]
C5  0.1uF 50V  [C0603-XXXXXX-XXX]
C6  0.01 uF 6.3V  [C0603-XXXXXX-XXX]
C7  0.1uF 50V  [C0603-XXXXXX-XXX]
C8  0.01 uF 6.3V  [C0603-XXXXXX-XXX]
C9  0.1uF 50V  [C0603-XXXXXX-XXX]
C10  0.01 uF 6.3V  [C0603-XXXXXX-XXX]
C11  0.1uF 50V  [C0603-XXXXXX-XXX]
C12  0.01 uF 6.3V  [C0603-XXXXXX-XXX]
C13  0.1uF 50V  [C0603-XXXXXX-XXX]
C14  0.01 uF 6.3V  [C0603-XXXXXX-XXX]
C15  0.1uF 50V  [C0603-XXXXXX-XXX]
C16  0.01 uF 6.3V  [C0603-XXXXXX-XXX]
C17  0.1uF 50V  [C0603-XXXXXX-XXX]
C18  0.01 uF 6.3V  [C0603-XXXXXX-XXX]
C19  0.1uF 50V  [C0603-XXXXXX-XXX]
C20  0.01 uF 6.3V  [C0603-XXXXXX-XXX]
C21  0.1uF 50V  [C0603-XXXXXX-XXX]
C22  0.01 uF 6.3V  [C0603-XXXXXX-XXX]
C23  0.1uF 50V  [C0603-XXXXXX-XXX]
C24  0.01 uF 6.3V  [C0603-XXXXXX-XXX]
C25  0.1uF 50V  [C0603-XXXXXX-XXX]
C26  0.01 uF 6.3V  [C0603-XXXXXX-XXX]
C27  0.1uF 50V  [C0603-XXXXXX-XXX]
C28  0.01 uF 6.3V  [C0603-XXXXXX-XXX]
C29  0.1uF 50V  [C0603-XXXXXX-XXX]
C30  0.01 uF 6.3V  [C0603-XXXXXX-XXX]
COB_BOTTOM1  SDL-116-G-19  [CON32_2X16_TU_DSL_SAI]
COB_BOTTOM2  SDL-116-G-19  [CON32_2X16_TU_DSL_SAI]
COB_LEFT1  SDL-116-G-19  [CON32_2X16_TU_DSL_SAI]
COB_LEFT2  SDL-116-G-19  [CON32_2X16_TU_DSL_SAI]
COB_RIGHT1  SDL-116-G-19  [CON32_2X16_TU_DSL_SAI]
COB_RIGHT2  SDL-116-G-19  [CON32_2X16_TU_DSL_SAI]
COB_TOP1  SDL-116-G-19  [CON32_2X16_TU_DSL_SAI]
COB_TOP2  SDL-116-G-19  [CON32_2X16_TU_DSL_SAI]

### Ports
alert_major_bus_o (bidir, see Main[3C], VHDCI[4C]), alert_major_internal_o (bidir, see Main[3C], VHDCI[1C]), alert_minor_o (bidir, see Main[3C], VHDCI[4C]), boot_addr_serial_in (bidir, see Main[3B], VHDCI[1C]), boot_addr_shift_en (bidir, see Main[3C], VHDCI[4C]), core_sleep_o (bidir, see Main[3C], VHDCI[1C]), data_err_i (bidir, see Main[3B], VHDCI[1D]), data_gnt_i (bidir, see Main[3E], VHDCI[3C]), data_req_o (bidir, see Main[3B], VHDCI[2C]), data_rvalid_i (bidir, see Main[3B], VHDCI[1D]), data_wdata_integ_o_[0..6] (bidir, see Main[3B], VHDCI[6C]), data_we_o (bidir, see Main[3E], VHDCI[4D]), debug_req_i (bidir, see Main[3B], VHDCI[2C]), double_fault_seen_o (bidir, see Main[3B], VHDCI[1D]), fast_clk_i (bidir, see Main[3D], VHDCI[2C]), fetch_enable_i (bidir, see Main[3C], VHDCI[1C]), hard_id_serial_in (bidir, see Main[3B], VHDCI[1C]), hard_id_shift_en (bidir, see Main[3C], VHDCI[4C]), instr_err_i (bidir, see Main[3B], VHDCI[1C]), instr_gnt_i (bidir, see Main[3B], VHDCI[1C]), instr_req_o (bidir, see Main[3C], VHDCI[4C]), instr_rvalid_i (bidir, see Main[3F], VHDCI[1C]), irq_external_i (bidir, see Main[3C], VHDCI[1C]), irq_fast_i[0..14] (bidir, see Main[3C], VHDCI[6C]), irq_nm_i (bidir, see Main[3C], VHDCI[4C]), irq_software_i (bidir, see Main[3C], VHDCI[1C]), irq_timer_i (bidir, see Main[3C], VHDCI[4C]), redundancy_sel_CSR (bidir, see Main[3E], VHDCI[2C]), redundancy_sel_EX (bidir, see Main[3E], VHDCI[3C]), redundancy_sel_IC (bidir, see Main[3D], VHDCI[2C]), redundancy_sel_ID (bidir, see Main[3E], VHDCI[2C]), redundancy_sel_IF (bidir, see Main[3E], VHDCI[3C]), redundancy_sel_LSU (bidir, see Main[3E], VHDCI[2C]), redundancy_sel_RF (bidir, see Main[3E], VHDCI[3C]), redundancy_sel_WB (bidir, see Main[3E], VHDCI[3C]), rst_ni (bidir, see Main[3E], VHDCI[4D]), scan_en (bidir, see Main[3D], VHDCI[2C]), scan_in_cs_p (bidir, see Main[3D], VHDCI[6D]), scan_in_cs_r (bidir, see Main[3C], VHDCI[1D]), scan_in_db1_p (bidir, see Main[3D], VHDCI[6C]), scan_in_db1_r (bidir, see Main[3C], VHDCI[1C]), scan_in_db2_p (bidir, see Main[3E], VHDCI[3C]), scan_in_db2_r (bidir, see Main[3E], VHDCI[2D]), scan_in_ex_p (bidir, see Main[3D], VHDCI[4C]), scan_in_ex_r (bidir, see Main[3C], VHDCI[1D]), scan_in_id_p (bidir, see Main[3D], VHDCI[4C]), scan_in_id_r (bidir, see Main[3D], VHDCI[1D]), scan_in_if_p (bidir, see Main[3D], VHDCI[4C]), scan_in_if_r (bidir, see Main[3D], VHDCI[1D]), scan_in_ls_p (bidir, see Main[3D], VHDCI[6D]), scan_in_ls_r (bidir, see Main[3C], VHDCI[1D]), scan_in_rf_p (bidir, see Main[3D], VHDCI[6D]), scan_in_rf_r (bidir, see Main[3C], VHDCI[1D]), scan_in_serdes_a_p (bidir, see Main[3E], VHDCI[3D]), scan_in_serdes_b_p (bidir, see Main[3E], VHDCI[3D]), scan_in_tb1_p (bidir, see Main[3E], VHDCI[3C]), scan_in_tb1_r (bidir, see Main[3F], VHDCI[2D]), scan_in_tb2_p (bidir, see Main[3E], VHDCI[3C]), scan_in_tb2_r (bidir, see Main[3E], VHDCI[2C]), scan_in_wb_p (bidir, see Main[3D], VHDCI[6D]), scan_in_wb_r (bidir, see Main[3C], VHDCI[1D]), scan_out_cs_p (bidir, see Main[3D], VHDCI[6D]), scan_out_cs_r (bidir, see Main[3C], VHDCI[1D]), scan_out_db1_p (bidir, see Main[3D], VHDCI[1D]), scan_out_db1_r (bidir, see Main[3C], VHDCI[1C]), scan_out_db2_p (bidir, see Main[3E], VHDCI[3C]), scan_out_db2_r (bidir, see Main[3E], VHDCI[2D]), scan_out_ex_p (bidir, see Main[3D], VHDCI[4C]), scan_out_ex_r (bidir, see Main[3C], VHDCI[1D]), scan_out_id_p (bidir, see Main[3D], VHDCI[4C]), scan_out_id_r (bidir, see Main[3D], VHDCI[1D]), scan_out_if_p (bidir, see Main[3D], VHDCI[4C]), scan_out_if_r (bidir, see Main[3F], VHDCI[1D]), scan_out_ls_p (bidir, see Main[3D], VHDCI[6D]), scan_out_ls_r (bidir, see Main[3C], VHDCI[1D]), scan_out_rf_p (bidir, see Main[3D], VHDCI[6D]), scan_out_rf_r (bidir, see Main[3C], VHDCI[1C]), scan_out_serdes_a_p (bidir, see Main[3D], VHDCI[2C]), scan_out_serdes_b_p (bidir, see Main[3D], VHDCI[2C]), scan_out_tb1_p (bidir, see Main[3E], VHDCI[3C]), scan_out_tb1_r (bidir, see Main[3F], VHDCI[2D]), scan_out_tb2_p (bidir, see Main[3E], VHDCI[3C]), scan_out_tb2_r (bidir, see Main[3E], VHDCI[2C]), scan_out_wb_p (bidir, see Main[3D], VHDCI[6D]), scan_out_wb_r (bidir, see Main[3C], VHDCI[1D]), scan_rst_ni (bidir, see Main[3E], VHDCI[3C]), serdes_data_addr_o_[0..15] (bidir, see Main[3B], VHDCI[6C]), serdes_data_be_o_[0..1] (bidir, see Main[3B], VHDCI[6C]), serdes_data_rdata_i_[0..15] (bidir, see Main[3B], VHDCI[6C]), serdes_data_wdata_o_[0..15] (bidir, see Main[3B], VHDCI[6C]), serdes_instr_addr_o_[0..15] (bidir, see Main[3B], VHDCI[6C]), serdes_instr_rdata_i[0..15] (bidir, see Main[3B], VHDCI[6C]), slow_clk_i (bidir, see Main[3E], VHDCI[3C]), test_en_i (bidir, see Main[3D], VHDCI[2C])

### Nets
VDD: C1.1 C2.1 C3.1 C4.1 C5.1 C6.1 C7.1 C8.1 C9.1 C10.1 C11.1 C12.1 C13.1 C14.1 C15.1 C16.1 C17.1 C18.1 C19.1 C20.1 C21.1 C22.1 C23.1 C24.1 C25.1 C26.1 C27.1 C28.1 C29.1 C30.1 COB_BOTTOM1.2 COB_BOTTOM2.2 COB_BOTTOM2.32 COB_LEFT1.4 COB_LEFT1.18 COB_LEFT2.4 COB_LEFT2.22 COB_RIGHT1.8 COB_RIGHT1.22 COB_RIGHT2.4 COB_RIGHT2.16 COB_RIGHT2.30 COB_TOP1.2 COB_TOP2.2 COB_TOP2.32
VSS: C1.2 C2.2 C3.2 C4.2 C5.2 C6.2 C7.2 C8.2 C9.2 C10.2 C11.2 C12.2 C13.2 C14.2 C15.2 C16.2 C17.2 C18.2 C19.2 C20.2 C21.2 C22.2 C23.2 C24.2 C25.2 C26.2 C27.2 C28.2 C29.2 C30.2 COB_BOTTOM1.1 COB_BOTTOM1.3 COB_BOTTOM1.4 COB_BOTTOM1.15 COB_BOTTOM1.16 COB_BOTTOM1.23 COB_BOTTOM1.26 COB_BOTTOM2.1 COB_BOTTOM2.3 COB_BOTTOM2.4 COB_BOTTOM2.18 COB_BOTTOM2.29 COB_BOTTOM2.30 COB_BOTTOM2.31 COB_LEFT1.2 COB_LEFT1.3 COB_LEFT1.6 COB_LEFT1.17 COB_LEFT1.20 COB_LEFT1.28 COB_LEFT2.3 COB_LEFT2.6 COB_LEFT2.14 COB_LEFT2.21 COB_LEFT2.24 COB_LEFT2.32 COB_RIGHT1.7 COB_RIGHT1.10 COB_RIGHT1.15 COB_RIGHT1.19 COB_RIGHT1.21 COB_RIGHT1.27 COB_RIGHT2.1 COB_RIGHT2.3 COB_RIGHT2.10 COB_RIGHT2.18 COB_RIGHT2.24 COB_RIGHT2.29 COB_TOP1.1 COB_TOP1.4 COB_TOP1.13 COB_TOP1.14 COB_TOP1.23 COB_TOP1.24 COB_TOP2.1 COB_TOP2.3 COB_TOP2.4 COB_TOP2.17 COB_TOP2.29 COB_TOP2.30 COB_TOP2.31  [also labelled GND]
alert_major_bus_o: COB_RIGHT2.21 ; port alert_major_bus_o
alert_major_internal_o: COB_RIGHT2.20 ; port alert_major_internal_o
alert_minor_o: COB_RIGHT2.19 ; port alert_minor_o
boot_addr_serial_in: COB_LEFT2.26 ; port boot_addr_serial_in
boot_addr_shift_en: COB_LEFT2.27 ; port boot_addr_shift_en
core_sleep_o: COB_RIGHT2.22 ; port core_sleep_o
data_err_i: COB_RIGHT1.17 ; port data_err_i
data_gnt_i: COB_TOP2.27 ; port data_gnt_i
data_req_o: COB_TOP2.28 ; port data_req_o
data_rvalid_i: COB_TOP2.26 ; port data_rvalid_i
data_wdata_integ_o0: COB_TOP1.8
data_wdata_integ_o1: COB_TOP1.7
data_wdata_integ_o2: COB_TOP1.10
data_wdata_integ_o3: COB_TOP1.9
data_wdata_integ_o4: COB_TOP1.12
data_wdata_integ_o5: COB_TOP1.11
data_wdata_integ_o6: COB_TOP1.16
data_we_o: COB_TOP2.25 ; port data_we_o
debug_req_i: COB_RIGHT2.14 ; port debug_req_i
double_fault_seen_o: COB_RIGHT2.15 ; port double_fault_seen_o
fast_clk_i: COB_LEFT2.2 ; port fast_clk_i
fetch_enable_i: COB_RIGHT2.17 ; port fetch_enable_i
hard_id_serial_in: COB_LEFT2.28 ; port hard_id_serial_in
hard_id_shift_en: COB_LEFT2.29 ; port hard_id_shift_en
instr_err_i: COB_LEFT1.1 ; port instr_err_i
instr_gnt_i: COB_LEFT2.17 ; port instr_gnt_i
instr_req_o: COB_LEFT2.18 ; port instr_req_o
instr_rvalid_i: COB_LEFT2.16 ; port instr_rvalid_i
irq_external_i: COB_RIGHT1.23 ; port irq_external_i
irq_fast_i0: COB_RIGHT2.12
irq_fast_i1: COB_RIGHT2.11
irq_fast_i2: COB_RIGHT2.9
irq_fast_i3: COB_RIGHT2.8
irq_fast_i4: COB_RIGHT2.7
irq_fast_i5: COB_RIGHT2.6
irq_fast_i6: COB_RIGHT2.5
irq_fast_i7: COB_RIGHT2.2
irq_fast_i8: COB_RIGHT1.31
irq_fast_i9: COB_RIGHT1.32
irq_fast_i10: COB_RIGHT1.29
irq_fast_i11: COB_RIGHT1.30
irq_fast_i12: COB_RIGHT1.28
irq_fast_i13: COB_RIGHT1.25
irq_fast_i14: COB_RIGHT1.26
irq_nm_i: COB_RIGHT2.13 ; port irq_nm_i
irq_software_i: COB_RIGHT1.20 ; port irq_software_i
irq_timer_i: COB_RIGHT1.24 ; port irq_timer_i
redundancy_sel_CSR: COB_BOTTOM1.6 ; port redundancy_sel_CSR
redundancy_sel_EX: COB_RIGHT2.28 ; port redundancy_sel_EX
redundancy_sel_IC: COB_BOTTOM1.8 ; port redundancy_sel_IC
redundancy_sel_ID: COB_RIGHT2.27 ; port redundancy_sel_ID
redundancy_sel_IF: COB_RIGHT2.26 ; port redundancy_sel_IF
redundancy_sel_LSU: COB_RIGHT2.31 ; port redundancy_sel_LSU
redundancy_sel_RF: COB_BOTTOM1.5 ; port redundancy_sel_RF
redundancy_sel_WB: COB_RIGHT2.32 ; port redundancy_sel_WB
rst_ni: COB_LEFT2.31 ; port rst_ni
scan_en: COB_RIGHT2.25 ; port scan_en
scan_in_cs_p: COB_BOTTOM1.31 ; port scan_in_cs_p
scan_in_cs_r: COB_BOTTOM2.5 ; port scan_in_cs_r
scan_in_db1_p: COB_BOTTOM2.12 ; port scan_in_db1_p
scan_in_db1_r: COB_BOTTOM2.13 ; port scan_in_db1_r
scan_in_db2_p: COB_BOTTOM2.21 ; port scan_in_db2_p
scan_in_db2_r: COB_BOTTOM2.22 ; port scan_in_db2_r
scan_in_ex_p: COB_BOTTOM1.17 ; port scan_in_ex_p
scan_in_ex_r: COB_BOTTOM1.20 ; port scan_in_ex_r
scan_in_id_p: COB_BOTTOM1.11 ; port scan_in_id_p
scan_in_id_r: COB_BOTTOM1.14 ; port scan_in_id_r
scan_in_if_p: COB_BOTTOM1.7 ; port scan_in_if_p
scan_in_if_r: COB_BOTTOM1.10 ; port scan_in_if_r
scan_in_ls_p: COB_BOTTOM1.27 ; port scan_in_ls_p
scan_in_ls_r: COB_BOTTOM1.30 ; port scan_in_ls_r
scan_in_rf_p: COB_BOTTOM2.8 ; port scan_in_rf_p
scan_in_rf_r: COB_BOTTOM2.9 ; port scan_in_rf_r
scan_in_serdes_a_p: COB_LEFT2.25 ; port scan_in_serdes_a_p
scan_in_serdes_b_p: COB_LEFT2.20 ; port scan_in_serdes_b_p
scan_in_tb1_p: COB_BOTTOM2.16 ; port scan_in_tb1_p
scan_in_tb1_r: COB_BOTTOM2.17 ; port scan_in_tb1_r
scan_in_tb2_p: COB_BOTTOM2.25 ; port scan_in_tb2_p
scan_in_tb2_r: COB_BOTTOM2.26 ; port scan_in_tb2_r
scan_in_wb_p: COB_BOTTOM1.21 ; port scan_in_wb_p
scan_in_wb_r: COB_BOTTOM1.24 ; port scan_in_wb_r
scan_out_cs_p: COB_BOTTOM2.6 ; port scan_out_cs_p
scan_out_cs_r: COB_BOTTOM2.7 ; port scan_out_cs_r
scan_out_db1_p: COB_BOTTOM2.14 ; port scan_out_db1_p
scan_out_db1_r: COB_BOTTOM2.15 ; port scan_out_db1_r
scan_out_db2_p: COB_BOTTOM2.23 ; port scan_out_db2_p
scan_out_db2_r: COB_BOTTOM2.24 ; port scan_out_db2_r
scan_out_ex_p: COB_BOTTOM1.19 ; port scan_out_ex_p
scan_out_ex_r: COB_BOTTOM1.22 ; port scan_out_ex_r
scan_out_id_p: COB_BOTTOM1.13 ; port scan_out_id_p
scan_out_id_r: COB_BOTTOM1.18 ; port scan_out_id_r
scan_out_if_p: COB_BOTTOM1.9 ; port scan_out_if_p
scan_out_if_r: COB_BOTTOM1.12 ; port scan_out_if_r
scan_out_ls_p: COB_BOTTOM1.29 ; port scan_out_ls_p
scan_out_ls_r: COB_BOTTOM1.32 ; port scan_out_ls_r
scan_out_rf_p: COB_BOTTOM2.10 ; port scan_out_rf_p
scan_out_rf_r: COB_BOTTOM2.11 ; port scan_out_rf_r
scan_out_serdes_a_p: COB_LEFT2.23 ; port scan_out_serdes_a_p
scan_out_serdes_b_p: COB_LEFT2.19 ; port scan_out_serdes_b_p
scan_out_tb1_p: COB_BOTTOM2.19 ; port scan_out_tb1_p
scan_out_tb1_r: COB_BOTTOM2.20 ; port scan_out_tb1_r
scan_out_tb2_p: COB_BOTTOM2.27 ; port scan_out_tb2_p
scan_out_tb2_r: COB_BOTTOM2.28 ; port scan_out_tb2_r
scan_out_wb_p: COB_BOTTOM1.25 ; port scan_out_wb_p
scan_out_wb_r: COB_BOTTOM1.28 ; port scan_out_wb_r
scan_rst_ni: COB_RIGHT2.23 ; port scan_rst_ni
serdes_data_addr_o0: COB_TOP2.6
serdes_data_addr_o1: COB_TOP2.7
serdes_data_addr_o2: COB_TOP2.8
serdes_data_addr_o3: COB_TOP2.9
serdes_data_addr_o4: COB_TOP2.10
serdes_data_addr_o5: COB_TOP2.11
serdes_data_addr_o6: COB_TOP2.12
serdes_data_addr_o7: COB_TOP2.13
serdes_data_addr_o8: COB_TOP2.14
serdes_data_addr_o9: COB_TOP2.15
serdes_data_addr_o10: COB_TOP2.16
serdes_data_addr_o11: COB_TOP2.18
serdes_data_addr_o12: COB_TOP2.19
serdes_data_addr_o13: COB_TOP2.20
serdes_data_addr_o14: COB_TOP2.21
serdes_data_addr_o15: COB_TOP2.22
serdes_data_be_o0: COB_TOP2.23
serdes_data_be_o1: COB_TOP2.24
serdes_data_rdata_i0: COB_RIGHT1.18
serdes_data_rdata_i1: COB_RIGHT1.16
serdes_data_rdata_i2: COB_RIGHT1.13
serdes_data_rdata_i3: COB_RIGHT1.14
serdes_data_rdata_i4: COB_RIGHT1.11
serdes_data_rdata_i5: COB_RIGHT1.12
serdes_data_rdata_i6: COB_RIGHT1.9
serdes_data_rdata_i7: COB_RIGHT1.5
serdes_data_rdata_i8: COB_RIGHT1.6
serdes_data_rdata_i9: COB_RIGHT1.3
serdes_data_rdata_i10: COB_RIGHT1.4
serdes_data_rdata_i11: COB_RIGHT1.1
serdes_data_rdata_i12: COB_RIGHT1.2
serdes_data_rdata_i13: COB_TOP1.3
serdes_data_rdata_i14: COB_TOP1.6
serdes_data_rdata_i15: COB_TOP1.5
serdes_data_wdata_o0: COB_TOP1.15
serdes_data_wdata_o1: COB_TOP1.18
serdes_data_wdata_o2: COB_TOP1.17
serdes_data_wdata_o3: COB_TOP1.20
serdes_data_wdata_o4: COB_TOP1.19
serdes_data_wdata_o5: COB_TOP1.22
serdes_data_wdata_o6: COB_TOP1.21
serdes_data_wdata_o7: COB_TOP1.26
serdes_data_wdata_o8: COB_TOP1.25
serdes_data_wdata_o9: COB_TOP1.28
serdes_data_wdata_o10: COB_TOP1.27
serdes_data_wdata_o11: COB_TOP1.30
serdes_data_wdata_o12: COB_TOP1.29
serdes_data_wdata_o13: COB_TOP1.32
serdes_data_wdata_o14: COB_TOP1.31
serdes_data_wdata_o15: COB_TOP2.5
serdes_instr_addr_o0: COB_LEFT1.26
serdes_instr_addr_o1: COB_LEFT1.25
serdes_instr_addr_o2: COB_LEFT1.27
serdes_instr_addr_o3: COB_LEFT1.30
serdes_instr_addr_o4: COB_LEFT1.29
serdes_instr_addr_o5: COB_LEFT1.32
serdes_instr_addr_o6: COB_LEFT2.1
serdes_instr_addr_o7: COB_LEFT2.5
serdes_instr_addr_o8: COB_LEFT2.7
serdes_instr_addr_o9: COB_LEFT2.8
serdes_instr_addr_o10: COB_LEFT2.9
serdes_instr_addr_o11: COB_LEFT2.10
serdes_instr_addr_o12: COB_LEFT2.11
serdes_instr_addr_o13: COB_LEFT2.12
serdes_instr_addr_o14: COB_LEFT2.13
serdes_instr_addr_o15: COB_LEFT2.15
serdes_instr_rdata_i0: COB_LEFT1.5
serdes_instr_rdata_i1: COB_LEFT1.8
serdes_instr_rdata_i2: COB_LEFT1.7
serdes_instr_rdata_i3: COB_LEFT1.10
serdes_instr_rdata_i4: COB_LEFT1.9
serdes_instr_rdata_i5: COB_LEFT1.12
serdes_instr_rdata_i6: COB_LEFT1.11
serdes_instr_rdata_i7: COB_LEFT1.14
serdes_instr_rdata_i8: COB_LEFT1.13
serdes_instr_rdata_i9: COB_LEFT1.16
serdes_instr_rdata_i10: COB_LEFT1.15
serdes_instr_rdata_i11: COB_LEFT1.19
serdes_instr_rdata_i12: COB_LEFT1.22
serdes_instr_rdata_i13: COB_LEFT1.21
serdes_instr_rdata_i14: COB_LEFT1.24
serdes_instr_rdata_i15: COB_LEFT1.23
slow_clk_i: COB_LEFT1.31 ; port slow_clk_i
test_en_i: COB_LEFT2.30 ; port test_en_i

### Buses and harness runs
bus data_wdata_integ_o[0..6] = port data_wdata_integ_o_[0..6]
bus irq_fast_i[0..14] = port irq_fast_i[0..14]
bus serdes_data_addr_o[0..15] = port serdes_data_addr_o_[0..15]
bus serdes_data_be_o[0..1] = port serdes_data_be_o_[0..1]
bus serdes_data_rdata_i[0..15] = port serdes_data_rdata_i_[0..15]
bus serdes_data_wdata_o[0..15] = port serdes_data_wdata_o_[0..15]
bus serdes_instr_addr_o[0..15] = port serdes_instr_addr_o_[0..15]
bus serdes_instr_rdata_i[0..15] = port serdes_instr_rdata_i[0..15]

### Notes on the sheet
- Samtec Inc. SDL-116-G-19

### Library data of the parts
C1 C3 C5 C7 C9 C11 C13 C15 C17 C19 C21 C23 C25 C27 C29 = C0603C104M5RAC7867: 0.1 µF ±20% 50V Ceramic Capacitor X7R 0603; KMI: 821327; Value: 0.1uF 50V
C2 C4 C6 C8 C10 C12 C14 C16 C18 C20 C22 C24 C26 C28 C30 = C0603F103M9RACTU: Multilayer Ceramic Capacitors MLCC - SMD/SMT 6.3V 0.01uF X7R 0603 20%; Value: 0.01 uF 6.3V